# EAGLE design VgaGen (EAGLE 4.11)
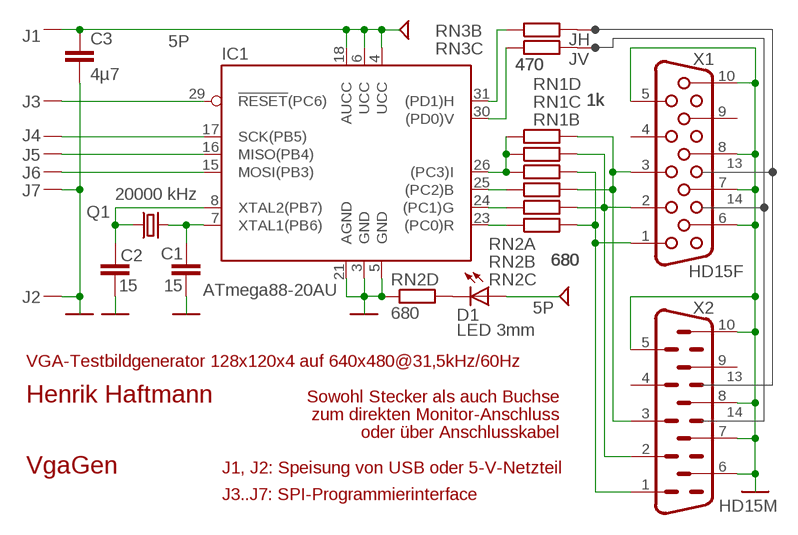
[diagram p0: schematic, sheet 1]

## Parts
C1  15  C  [0603]
C2  15  C  [0603]
C3  4µ7  C  [0603]
D1  LED 3mm  LED3MM  [LED3MM]
IC1  ATmega88-20AU  MEGA88-TQ  [TQFP32-08]
J1  PAD2  [SMD-2MM]
J2  PAD2  [SMD-2MM]
J3  PAD1.5  [SMD-1MM5]
J4  PAD1.5  [SMD-1MM5]
J5  PAD1.5  [SMD-1MM5]
J6  PAD1.5  [SMD-1MM5]
J7  PAD1.5  [SMD-1MM5]
JH  PAD1.5  [SMD-1MM5]
JV  PAD1.5  [SMD-1MM5]
Q1  20000 kHz  CRYSTALHC49S  [HC49/S]
RN1  1k  RN-4P1206  [R-4P]
RN2  680  RN-4P1206  [R-4P]
RN3  470  RN-4P1206  [R-4P]
X1  HD15F  HF15  [HDF15H]
X2  HD15M  HM15  [HDM15H]

## Nets
5P: C3.1 D1.A IC1.4(UCC) IC1.6(UCC) IC1.18(AUCC) J1.1
B: RN1.5 RN2.8 X1.3 X2.3
G: RN1.6 RN2.7 X1.2 X2.2
GND: C1.2 C2.2 C3.2 IC1.3(GND) IC1.5(GND) IC1.21(AGND) J2.1 J7.1 RN2.4 X1.5 X1.6 X1.7 X1.8 X1.10 X2.5 X2.6 X2.7 X2.8 X2.10
MISO: IC1.16(MISO(PB4)) J5.1
MOSI: IC1.15(MOSI(PB3)) J6.1
N$1: IC1.26((PC3)I) RN1.2 RN1.3 RN1.4
N$2: IC1.30((PD0)V) RN3.3
N$3: IC1.25((PC2)B) RN2.1
N$4: IC1.24((PC1)G) RN2.2
N$5: IC1.23((PC0)R) RN2.3
N$6: IC1.31((PD1)H) RN3.2
N$7: JV.1 RN3.6
N$9: JH.1 RN3.7
N$10: D1.K RN2.5
R: RN1.7 RN2.6 X1.1 X2.1
RESET: IC1.29(!RESET!(PC6)) J3.1
SCK: IC1.17(SCK(PB5)) J4.1
X1: C1.1 IC1.7(XTAL1(PB6)) Q1.1
X2: C2.1 IC1.8(XTAL2(PB7)) Q1.2
Unconnected: RN1.1 RN1.8 RN3.1 RN3.4 RN3.5 RN3.8 X1.4 X1.9 X2.4 X2.9

## Notes on the sheet
- 13
- 14
- VGA-Testbildgenerator 128x120x4 auf 640x480@31,5kHz/60Hz
- 13
- Henrik Haftmann | Sowohl Stecker als auch Buchse
- zum direkten Monitor-Anschluss | 14
- oder über Anschlusskabel
- J1, J2: Speisung von USB oder 5-V-Netzteil
- J3..J7: SPI-Programmierinterface

## Library data of the parts
C1-C3 = VgaGen:C: Kondensator
D1 = VgaGen:LED: Leuchtdiode 2 Anschlüsse
IC1 = VgaGen:MEGA*8-: 8-bit-Mikrocontroller 8bit, 16MHz, Harvard 4/8/16 Kbyte FLASH (schreibbar durch Firmware) 1 KByte RAM 0,5 KByte EEPROM 1x UART, 8 Kanal 10-bit-ADU, 2x Timer, I²C, SPI Achtung! Reduziertes Schaltbild nur passend für VGA-Testbildgenerator
J1-J7 JH JV = VgaGen:PAD
Q1 = VgaGen:CRYSTAL: Quarz 2 Anschlüsse
RN1-RN3 = VgaGen:RN-4P: Widerstandsnetzwerk 4 Parallel
X1 = VgaGen:HF15: SubD-Buchse 15-pol. HD Kantenmontage, nur Pins 1..10
X2 = VgaGen:HM15: SubD-Stecker 15-pol. HD Kantenmontage, nur Pins 1..10

## Board
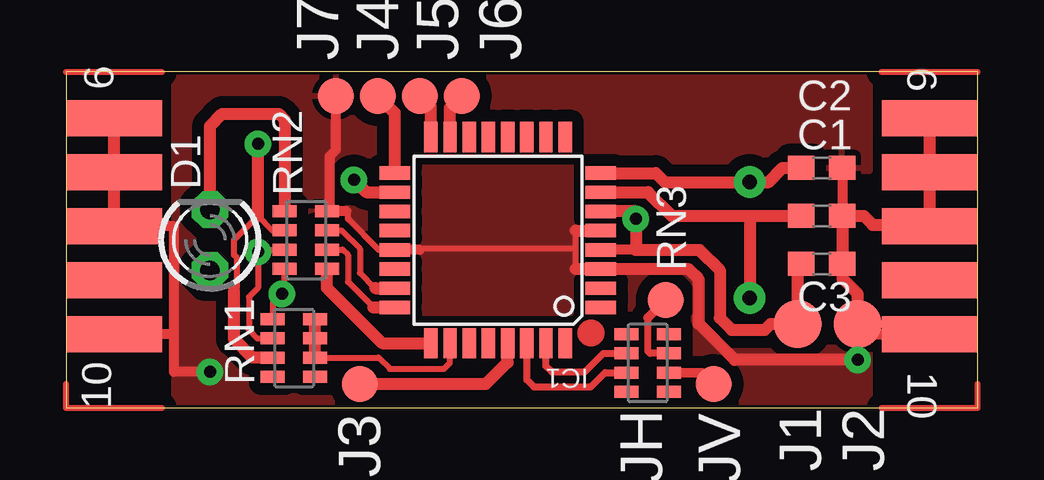
[diagram p1: board, top side]
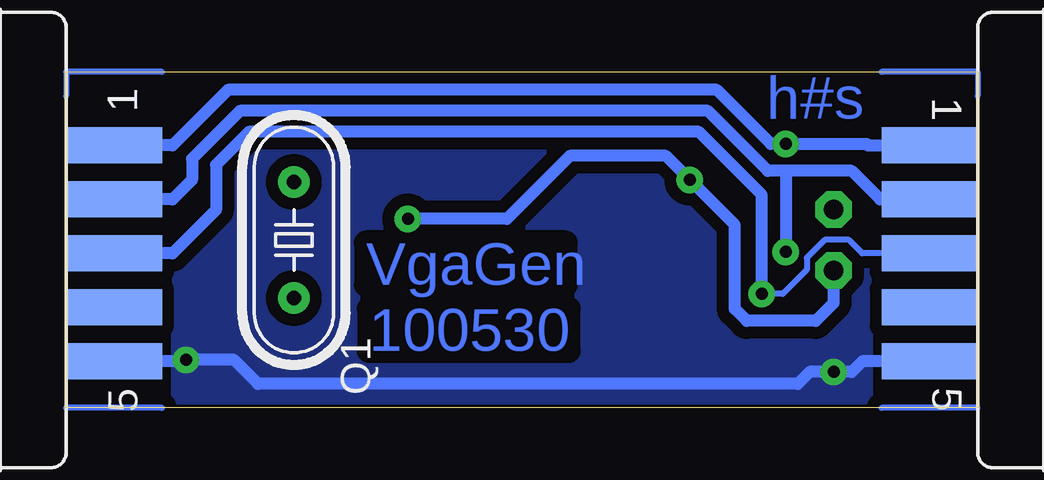
[diagram p2: board, bottom side, seen from below]

Size 38 x 14 mm. Coordinates in mm from the lower left corner, seen from the top.
Outline: 0,0 38,0 38,14 0,14 0,0
Copper layers (1*16): Top 0.035mm / dielectric 1mm / Bottom 0.035mm
Design rules "Felber": minimum track width 0.2mm, minimum drill 0.3mm, track to track 0.2mm, track to pad 0.2mm, pad to pad 0.2mm, via to via 0.2mm, smd to smd 0mil, copper to edge 0mil, drill to drill 0.3mm, minimum pad ring 0.35mm, minimum via ring 0.3mm, stop-mask expansion 4mil, vias tented up to drill 0.2mm, thermal gap 10mil

### Footprints (pad centres in the part's own frame; a part is rotated, then mirrored left to right if it is on the bottom)
0603 = smd 1.1 x 1: 1 -0.85,0; 2 0.85,0
LED3MM = drill 0.813 octagon: A -1.27,0; K 1.27,0
TQFP32-08 = smd 1.27 x 0.559: 1 -4.293,2.8; 2 -4.293,2; 3 -4.293,1.2; 4 -4.293,0.4; 5 -4.293,-0.4; 6 -4.293,-1.2; 7 -4.293,-2; 8 -4.293,-2.8; 17 4.293,-2.8; 18 4.293,-2; 19 4.293,-1.2; 20 4.293,-0.4; 21 4.293,0.4; 22 4.293,1.2; 23 4.293,2; 24 4.293,2.8 | smd 0.559 x 1.27: 9 -2.8,-4.293; 10 -2,-4.293; 11 -1.2,-4.293; 12 -0.4,-4.293; 13 0.4,-4.293; 14 1.2,-4.293; 15 2,-4.293; 16 2.8,-4.293; 25 2.8,4.293; 26 2,4.293; 27 1.2,4.293; 28 0.4,4.293; 29 -0.4,4.293; 30 -1.2,4.293; 31 -2,4.293; 32 -2.8,4.293
SMD-2MM = smd 2 x 2: 1 0,0
SMD-1MM5 = smd 1.5 x 1.5: 1 0,0
HC49/S = drill 0.61 round: 1 -2.413,0; 2 2.413,0
R-4P = smd 0.5 x 1: 1 -1.2,-0.88; 2 -0.4,-0.88; 3 0.4,-0.88; 4 1.2,-0.88; 5 1.2,0.88; 6 0.4,0.88; 7 -0.4,0.88; 8 -1.2,0.88
HDF15H = smd 1.5 x 4: 1 3.938,2; 2 1.688,2; 3 -0.562,2; 4 -2.812,2; 5 -5.062,2 | smd 1.5 x 4 bottom: 6 5.062,2; 7 2.812,2; 8 0.562,2; 9 -1.688,2; 10 -3.938,2
HDM15H = smd 1.5 x 4: 1 -3.938,2; 2 -1.688,2; 3 0.562,2; 4 2.812,2; 5 5.062,2 | smd 1.5 x 4 bottom: 6 -5.062,2; 7 -2.812,2; 8 -0.562,2; 9 1.688,2; 10 3.938,2

### Placement (x,y rotation side)
C1  31.5,8 0 top
C2  31.5,10 0 top
C3  31.5,6 0 top
D1  6,7 90 top
IC1  18,6.99 180 top
J1  30.5,3.5 0 top
J2  33,3.5 0 top
J3  12.25,1 0 top
J4  13,13 0 top
J5  14.75,13 0 top
J6  16.5,13 0 top
J7  11.25,13 0 top
JH  25,4.5 0 top
JV  27,1 0 top
Q1  28.5,7 90 bottom
RN1  9.5,2.5 90 top
RN2  10,7 90 top
RN3  24.25,1.88 270 top
X1  0,7 90 bottom
X2  38,7 270 bottom

### Tracks (layer width: path | path; a pad name or v marks a point on that pad's centre or on a via)
5P  (via drill 0.5)
  Top 0.254: 30.5,6 C3.1
  Top 0.406: 23.75,6.59 IC1.4
  Top 0.5: IC1.18 12.51,8.99 v12,9.5 | IC1.6 23.75,8.19 v23.75,7.88 23.75,6.59 26.41,6.59 27.25,5.75 27.25,3.75 27.75,3.25 29.12,3.25 29.38,3.5 J1.1 30.5,6
  Bottom 0.5: D1.A 6,4.38 6.75,3.62 9.62,3.62 10.12,4.12 10.12,7.62 v12,9.5 13,10.5 17,10.5 19.62,7.88 v23.75,7.88
B  (via drill 0.5)
  Top 0.254: RN2.8 9.12,4.87 v9,4.75 8.62,4.37 RN1.5
  Bottom 0.254: X1.3 4.81,6.44 5.38,7 6.38,7 7.12,6.25 7.12,5.75 8.12,4.75 v9,4.75
  Bottom 0.5: X2.3 33.56,6.44 31.75,8.25 31.75,10.12 30.38,11.5 11.62,11.5 9,8.88 v9,4.75
G  (via drill 0.5)
  Top 0.254: RN1.6 7.97,2.9 7.62,3.25 7.62,4.62 8,5 v8,6.5 8.1,6.6 RN2.7
  Bottom 0.5: X1.2 4.06,8.69 5.25,9.88 8,9.88 | X2.2 33.56,8.69 32.75,9.5 32.75,10.38 30.75,12.38 11.25,12.38 8.75,9.88 8,9.88 | 8,9.88 v8,6.5
GND  (via drill 0.5)
  Top 0.254: 11,8.2 RN2.4 | 11.68,8.2 11.75,8.12 11.75,7.88 13.04,6.59 IC1.21 | 14.75,6.59 14.75,6.62 21.25,6.62 | 21.25,5.79 21.25,6.62 | 21.25,6.62 21.25,7.39 | 32.38,10 C2.2 | 32.38,6 C3.2 | 32.38,8 C1.2 | 4.5,3.38 4.5,3.25 | X2.7 36,9.75 36.12,9.62 36,9.5 | 36,7.62 X2.8 | 33.56,3.06 33.62,3.06
  Top 0.406: 11.68,8.2 11,8.2 11,10.5 11.25,10.75 J7.1 | 14.75,6.59 IC1.21 | v33,2 J2.1 33.12,3.5 33.56,3.06 | 32.38,8 32.38,10 | X1.8 4.5,7.56 4.5,3.38 4.5,3.06 | 4.5,3.06 X1.10 | 4.5,3.06 4.5,1.5 v6,1.5 | 33.62,3.06 X2.10
  Top 0.5: 21.25,7.39 IC1.5 | 21.25,5.79 IC1.3 25.94,5.79 26.38,5.36 26.38,3.5 27.88,2 v33,2 | J2.1 33,4.75 32.38,5.38 32.38,6 32.38,8 | X1.6 X1.7 X1.8 | X2.7 X2.6 | 36,9.5 36,7.62 33.62,7.62 33.25,8 C1.2
  Bottom 0.254: v33,2 33.12,2 33.19,1.94
  Bottom 0.5: X1.5 4.81,1.94 5.25,1.5 v6,1.5 7,1.5 7.5,1 30,1 31,2 v33,2 | 33.19,1.94 X2.5
  pour Bottom (isolate 0.5): 4.5,13.75 4.5,0.25 33.5,0.25 33.5,13.75
  pour Top (isolate 0.5): 14.75,10.25 14.75,3.75 21.25,3.75 21.25,10.25
  pour Top (isolate 0.5): 4.5,13.75 4.5,0.25 33.5,0.25 33.5,2.5 31.5,2.5 31.5,9.88 33.5,9.88 33.5,13.75
MISO
  Top 0.5: IC1.16 15.21,12.54 J5.1
MOSI
  Top 0.254: 16,11.99 16,12
  Top 0.5: IC1.15 16,11.99 | 16,12 16,12.5 J6.1
N$1
  Top 0.254: RN1.2 13.03,2.1 13.5,1.62 15.75,1.62 16,1.88 IC1.26 | RN1.3 10.38,2.88
  Top 0.5: RN1.3 RN1.4 | RN1.2 10.38,2.88
N$2
  Top 0.3: IC1.30 19.2,1.17 19.5,0.88 21.88,0.88 22.48,1.48 RN3.3
N$3
  Top 0.5: RN2.1 10.88,5 13.18,2.7 IC1.25
N$4
  Top 0.254: RN2.2 11.53,6.6 11.75,6.38 11.75,5.25 12.81,4.19
  Top 0.5: 12.81,4.19 IC1.24
N$5
  Top 0.254: 12.88,4.99 12.25,5.62 12.25,6.62 11.47,7.4 RN2.3
  Top 0.5: 12.88,4.99 IC1.23
N$6
  Top 0.3: IC1.31 20,1.75 20.25,1.5 21.62,1.5 22.4,2.27 RN3.2
N$7
  Top 0.4: RN3.6 26.52,1.48 JV.1
N$9
  Top 0.3: RN3.7 24.35,2.27 24.25,2.38 24.25,3.75
  Top 0.4: 24.25,3.75 JH.1
N$10
  Top 0.5: D1.K 6,11.73 6.51,12.25 8.88,12.25 9.12,12.01 RN2.5
N$11
  Top 0.254: 0,14 4,14
N$12
  Top 0.254: 34,14 38,14
N$13
  Top 0.254: 38,1 38,0 34,0
N$14
  Top 0.254: 4,0 0,0 0,1
N$15
  Bottom 0.254: 0,13 0,14 4,14
N$16
  Bottom 0.254: 38,13 38,14 34,14
N$17
  Bottom 0.254: 34,0 38,0
N$18
  Bottom 0.254: 0,0 4,0
R  (via drill 0.5)
  Top 0.254: 7,4.88 7.12,5 7.12,6.25 7,6.38 7,7 8,8 8.6,7.4 RN2.6
  Top 0.5: 7,4.88 7,2.88 7.78,2.1 RN1.7 | 8,8 v8,11
  Bottom 0.5: X1.1 4.56,10.94 4.62,11 v8,11 8.62,11 10.88,13.25 31.25,13.25 33.56,10.94 X2.1
RESET
  Top 0.5: IC1.29 18.41,1.91 17.5,1 J3.1
SCK
  Top 0.5: IC1.17 13.71,12.29 J4.1
X1
  Top 0.5: IC1.7 24.26,8.99 25.25,8 28.5,8 | 28.5,8 C1.1 | 28.5,8 Q1.1
X2
  Top 0.5: IC1.8 24.59,9.79 24.96,9.41 Q1.2 29.29,9.41 29.88,10 C2.1
(copper drawn outside any net)
  shapes: Top circle x1

### Text on the board
Bottom: h#s | VgaGen | 100530
Measures: 14 | 38